# Altium schematic sheet Kocka_V3.1_ESP.SchDoc
size A
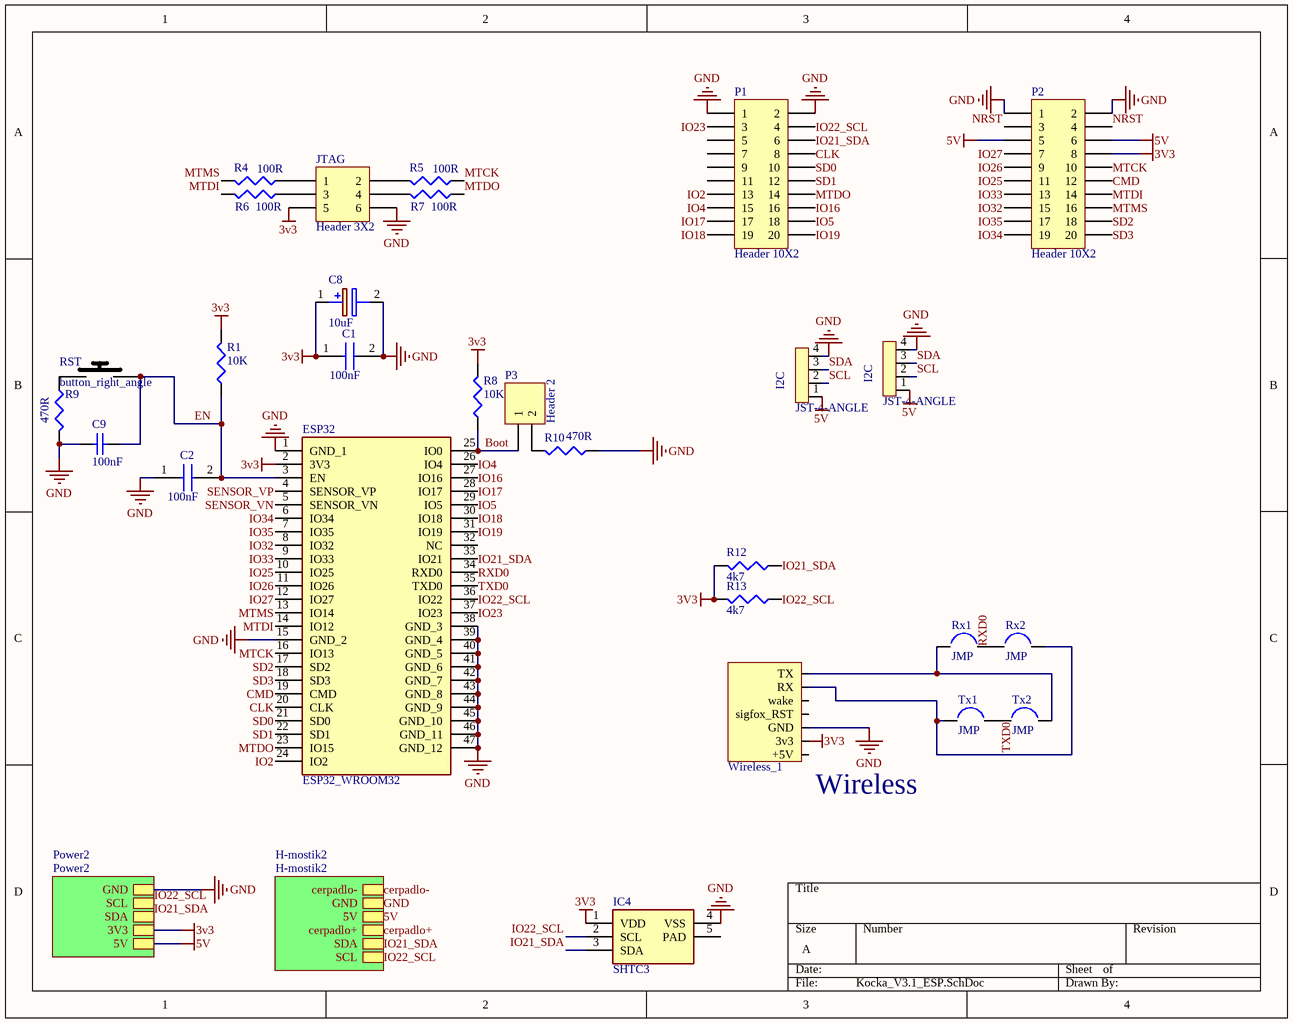
[diagram p0: Kocka_V3.1_ESP.SchDoc]

## Parts
(Parts that share a designator on the sheet are numbered #1, #2 ... from top to bottom, then left to right.)
C1  100nF  [CAPC1608X90N]
C2  100nF  [CAPC1608X90N]
C8  10uF  [CAPPM3216X180N]
C9  100nF  [1608[0603]]
ESP32  ESP32_WROOM32  [ESP32WROOM32]
I2C#1  JST-4-ANGLE  [JST-4-ANGLE]
I2C#2  JST-4-ANGLE  [JST-4-ANGLE]
IC4  SHTC3  [SHTC3]
JTAG  Header 3X2  [HDR2X3]
P1  Header 10X2  [HDR2X10]
P2  Header 10X2  [HDR2X10]
P3  Header 2  [HDR1X2]
R1  10K  [J1-0603]
R4  100R  [J1-0603]
R5  100R  [J1-0603]
R6  100R  [J1-0603]
R7  100R  [J1-0603]
R8  10K  [J1-0603]
R9  470R  [J1-0603]
R10  470R  [J1-0603]
R12  4k7  [J1-0603]
R13  4k7  [J1-0603]
RST  button_right_angle  [1825027-8]
Rx1  JMP  [JMP]
Rx2  JMP  [JMP]
Tx1  JMP  [JMP]
Tx2  JMP  [JMP]
Wireless_1  header7  [Wireless]  (value not drawn)

## Sub-sheets
H-mostik2 = H-mostik2: 5V, SCL, GND, SDA, cerpadlo+, cerpadlo-
Power2 = Power2: 3V3, SCL, SDA, 5V, GND

## Nets
3v3: C1.1 C8.1(+) ESP32.2(3V3) IC4.1(VDD) JTAG.5 P2.8 R1.2 R8.2 R12.2 R13.2 Wireless_1.2(3v3) ; sheet Power2/3V3
5V: I2C#1.1 I2C#2.1 P2.5 P2.6 ; sheet H-mostik2/5V, sheet Power2/5V
GND: C1.2 C2.1 C8.2(-) C9.1 ESP32.1(GND_1) ESP32.15(GND_2) ESP32.38(GND_3) ESP32.39(GND_4) ESP32.40(GND_5) ESP32.41(GND_6) ESP32.42(GND_7) ESP32.43(GND_8) ESP32.44(GND_9) ESP32.45(GND_10) ESP32.46(GND_11) ESP32.47(GND_12) I2C#1.4 I2C#2.4 IC4.4(VSS) JTAG.6 P1.1 P1.2 P2.1 P2.2 R9.2 R10.1 Wireless_1.3(GND) ; sheet H-mostik2/GND, sheet Power2/GND
Boot: ESP32.25(IO0) P3.1 R8.1
cerpadlo+: sheet H-mostik2/cerpadlo+
cerpadlo-: sheet H-mostik2/cerpadlo-
CLK: ESP32.20(CLK) P1.8
CMD: ESP32.19(CMD) P2.12
EN: C2.2 C9.2 ESP32.3(EN) R1.1 RST.2
IO2: ESP32.24(IO2) P1.13
IO4: ESP32.26(IO4) P1.15
IO5: ESP32.29(IO5) P1.18
IO16: ESP32.27(IO16) P1.16
IO17: ESP32.28(IO17) P1.17
IO18: ESP32.30(IO18) P1.19
IO19: ESP32.31(IO19) P1.20
IO21_SDA: ESP32.33(IO21) IC4.3(SDA) P1.6 R12.1 ; sheet H-mostik2/SDA, sheet Power2/SDA
IO22_SCL: ESP32.36(IO22) IC4.2(SCL) P1.4 R13.1 ; sheet H-mostik2/SCL, sheet Power2/SCL
IO23: ESP32.37(IO23) P1.3
IO25: ESP32.10(IO25) P2.11
IO26: ESP32.11(IO26) P2.9
IO27: ESP32.12(IO27) P2.7
IO32: ESP32.8(IO32) P2.15
IO33: ESP32.9(IO33) P2.13
IO34: ESP32.6(IO34) P2.19
IO35: ESP32.7(IO35) P2.17
MTCK: ESP32.16(IO13) P2.10 R5.1
MTDI: ESP32.14(IO12) P2.14 R6.2
MTDO: ESP32.23(IO15) P1.14 R7.1
MTMS: ESP32.13(IO14) P2.16 R4.2
NRST: P2.3 P2.4
RXD0: ESP32.34(RXD0) Rx1.2 Rx2.1
SCL: I2C#1.2 I2C#2.2
SD0: ESP32.21(SD0) P1.10
SD1: ESP32.22(SD1) P1.12
SD2: ESP32.17(SD2) P2.18
SD3: ESP32.18(SD3) P2.20
SDA: I2C#1.3 I2C#2.3
SENSOR_VN: ESP32.5(SENSOR_VN)
SENSOR_VP: ESP32.4(SENSOR_VP)
TXD0: ESP32.35(TXD0) Tx1.2 Tx2.1
NetJTAG_1: JTAG.1 R4.1
NetJTAG_2: JTAG.2 R5.2
NetJTAG_3: JTAG.3 R6.1
NetJTAG_4: JTAG.4 R7.2
NetP3_2: P3.2 R10.2
NetR9_1: R9.1 RST.1
NetRx1_1: Rx1.1 Tx2.2 Wireless_1.7(TX)
NetRx2_2: Rx2.2 Tx1.1 Wireless_1.6(RX)

Not connected (* = marked no-connect by the designer): ESP32 32(NC); IC4 5(PAD); P1 5 7 9 11; Wireless_1 1(+5V) 4(sigfox_RST) 5(wake)

## Notes on the sheet
- (near Wireless_1) Wireless

## Library data of the parts
C1 C2 = 06033D225MAT2A: Capacitor; Manufacturer_Name: AVX; Datasheet Link: https://componentsearchengine.com/Datasheets/1/06031A100FAT2A.pdf; Height: 0.9mm; Manufacturer_Part_Number: 06033D225MAT2A; Mouser Part Number: 581-06033D225MAT2A; Mouser Price/Stock: https://www.mouser.co.uk/ProductDetail/AVX/06033D225MAT2A?qs=%252BdQmOuGyFcGllV0VA4zyxA%3D%3D
C8 = TAJA106K004RNJ: Capacitor Polarised; Manufacturer_Name: AVX; Datasheet Link: http://www.farnell.com/datasheets/1680476.pdf; Height: 1.8mm; Manufacturer_Part_Number: TAJA106K004RNJ; Mouser Part Number: 581-TAJA106K004R; Mouser Price/Stock: https://www.mouser.com/Search/Refine.aspx?Keyword=581-TAJA106K004R
C9 = Cap Semi: Capacitor; Value: 100pF; Published: 8-Jun-2000; LatestRevisionDate: 29-May-2009; LatestRevisionNote: IPC-7351 Footprint Added.; PackageReference: C1206; Publisher: Altium Limited; PackageDescription: Chip Capacitor
ESP32 = ESP32_WROOM32: Integrated Circuit; Manufacturer_Name: Espressif Systems; Manufacturer_Part_Number: ESP32 WROOM32; Datasheet Link: https://www.espressif.com/sites/default/files/documentation/esp32-wroom-32_datasheet_en.pdf; Height: 3.2mm
I2C#1 I2C#2 = JST-4-ANGLE: NXW-04K
IC4 = SHTC3: Integrated Circuit; Manufacturer_Name: Sensirion; Datasheet Link: https://www.glynshop.com/erp/owweb/Daten/Datenblaetter/Sensirion/SHTC3.pdf; Height: 0mm; Manufacturer_Part_Number: SHTC3; Mouser Part Number: 403-SHTC3; Mouser Price/Stock: https://www.mouser.com/Search/Refine.aspx?Keyword=403-SHTC3
JTAG = Header 3X2: Header, 3-Pin, Dual row; LatestRevisionDate: 17-Jul-2002; LatestRevisionNote: Re-released for DXP Platform.; Publisher: Altium Limited
P1 P2 = Header 10X2: Header, 10-Pin, Dual row; LatestRevisionDate: 17-Jul-2002; LatestRevisionNote: Re-released for DXP Platform.; Publisher: Altium Limited
P3 = Header 2: Header, 2-Pin; LatestRevisionDate: 17-Jul-2002; LatestRevisionNote: Re-released for DXP Platform.; Publisher: Altium Limited
R1 R4-R10 = Res3: Resistor; Published: 8-Jun-2000; LatestRevisionDate: 29-May-2009; LatestRevisionNote: IPC-7351 Footprint Added.; PackageReference: J1-0603; Publisher: Altium Limited; PackageDescription: Chip Resistor
  R1 R8: Value: 10K
  R4-R7: Value: 100R
  R9 R10: Value: 470R
R12 R13 = Res3: Resistor; Value: 1K5; Published: 8-Jun-2000; LatestRevisionDate: 29-May-2009; LatestRevisionNote: IPC-7351 Footprint Added.; PackageReference: J1-0603; Publisher: Altium Limited; PackageDescription: Chip Resistor
RST = button_right_angle: Switch; Manufacturer_Name: TE Connectivity; Datasheet Link: http://www.te.com/commerce/DocumentDelivery/DDEController?Action=srchrtrv&DocNm=1825027&DocType=Customer+Drawing&DocLang=English; Manufacturer_Part_Number: 1825027-8; Mouser Part Number: 506-1825027-8; Mouser Price/Stock: https://www.mouser.com/Search/Refine.aspx?Keyword=506-1825027-8; RS Part Number: 7182389P; RS Price/Stock: http://uk.rs-online.com/web/p/products/7182389P
Wireless_1 = Wireless